# Altium project Power Switching Board.PrjPcb
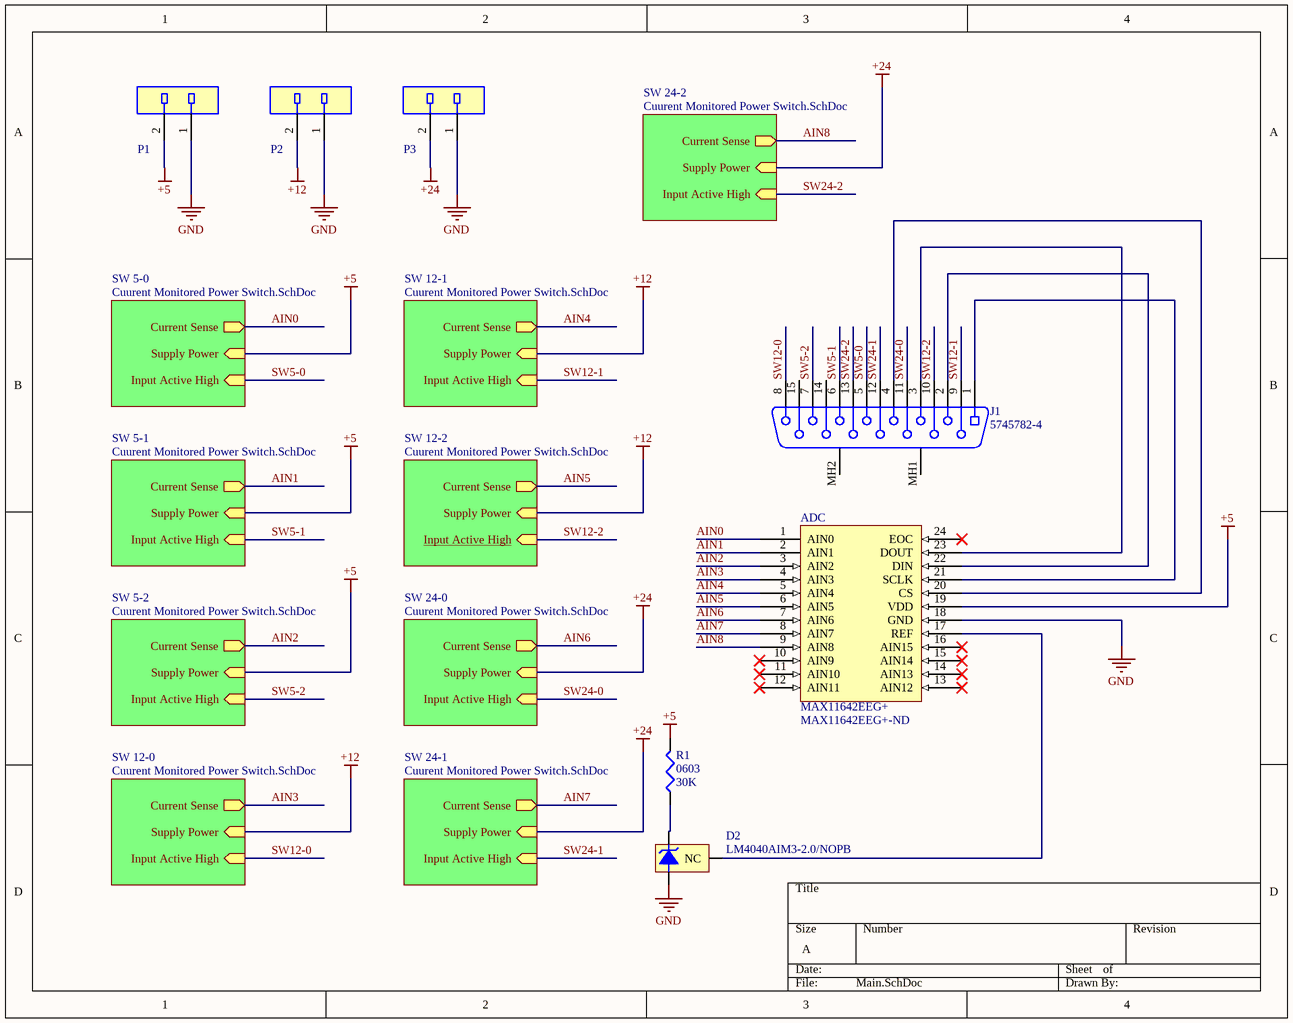
[diagram p0: Main.SchDoc]
2 sheets, 70 parts. Net scope: hierarchical (ports join the sheet entries above them; power ports are global).
Board file: Main.PcbDoc
Sheets:
  Main.SchDoc
    SW 5-0 = Cuurent Monitored Power Switch.SchDoc
    SW 5-1 = Cuurent Monitored Power Switch.SchDoc
    SW 5-2 = Cuurent Monitored Power Switch.SchDoc
    SW 12-0 = Cuurent Monitored Power Switch.SchDoc
    SW 12-1 = Cuurent Monitored Power Switch.SchDoc
    SW 12-2 = Cuurent Monitored Power Switch.SchDoc
    SW 24-0 = Cuurent Monitored Power Switch.SchDoc
    SW 24-1 = Cuurent Monitored Power Switch.SchDoc
    SW 24-2 = Cuurent Monitored Power Switch.SchDoc

## Sheet Main.SchDoc
size A

### Parts
ADC  MAX11642EEG+  Supplier Part Number 1: MAX11642EEG+-ND  [QSOP-24]
D2  LM4040AIM3-2.0/NOPB  [MF03A_L]
J1  5745782-4  [TECO-5745782-4_V]
P1  70553-0001  [Molex_70553-0001_MFG]  (value not drawn)
P2  70553-0001  [Molex_70553-0001_MFG]  (value not drawn)
P3  70553-0001  [Molex_70553-0001_MFG]  (value not drawn)
R1  0603  value 30K  [J1-0603]

### Sub-sheets
SW 5-0 = Cuurent Monitored Power Switch.SchDoc: Current Sense (out), Supply Power (in), Input Active High (in)
SW 5-1 = Cuurent Monitored Power Switch.SchDoc: Current Sense (out), Supply Power (in), Input Active High (in)
SW 5-2 = Cuurent Monitored Power Switch.SchDoc: Current Sense (out), Supply Power (in), Input Active High (in)
SW 12-0 = Cuurent Monitored Power Switch.SchDoc: Current Sense (out), Supply Power (in), Input Active High (in)
SW 12-1 = Cuurent Monitored Power Switch.SchDoc: Current Sense (out), Supply Power (in), Input Active High (in)
SW 12-2 = Cuurent Monitored Power Switch.SchDoc: Current Sense (out), Supply Power (in), Input Active High (in)
SW 24-0 = Cuurent Monitored Power Switch.SchDoc: Current Sense (out), Supply Power (in), Input Active High (in)
SW 24-1 = Cuurent Monitored Power Switch.SchDoc: Current Sense (out), Supply Power (in), Input Active High (in)
SW 24-2 = Cuurent Monitored Power Switch.SchDoc: Current Sense (out), Supply Power (in), Input Active High (in)

### Nets
+5: ADC.19(VDD) P1.2 R1.2 ; sheet SW 5-0/Supply Power, sheet SW 5-1/Supply Power, sheet SW 5-2/Supply Power
+12: P2.2 ; sheet SW 12-0/Supply Power, sheet SW 12-1/Supply Power, sheet SW 12-2/Supply Power
+24: P3.2 ; sheet SW 24-0/Supply Power, sheet SW 24-1/Supply Power, sheet SW 24-2/Supply Power
GND: ADC.18(GND) D2.2(-V) P1.1 P2.1 P3.1
AIN0: ADC.1(AIN0) ; sheet SW 5-0/Current Sense
AIN1: ADC.2(AIN1) ; sheet SW 5-1/Current Sense
AIN2: ADC.3(AIN2) ; sheet SW 5-2/Current Sense
AIN3: ADC.4(AIN3) ; sheet SW 12-0/Current Sense
AIN4: ADC.5(AIN4) ; sheet SW 12-1/Current Sense
AIN5: ADC.6(AIN5) ; sheet SW 12-2/Current Sense
AIN6: ADC.7(AIN6) ; sheet SW 24-0/Current Sense
AIN7: ADC.8(AIN7) ; sheet SW 24-1/Current Sense
AIN8: ADC.9(AIN8) ; sheet SW 24-2/Current Sense
SW5-0: J1.5 ; sheet SW 5-0/Input Active High
SW5-1: J1.6 ; sheet SW 5-1/Input Active High
SW5-2: J1.7 ; sheet SW 5-2/Input Active High
SW12-0: J1.8 ; sheet SW 12-0/Input Active High
SW12-1: J1.9 ; sheet SW 12-1/Input Active High
SW12-2: J1.10 ; sheet SW 12-2/Input Active High
SW24-0: J1.11 ; sheet SW 24-0/Input Active High
SW24-1: J1.12 ; sheet SW 24-1/Input Active High
SW24-2: J1.13 ; sheet SW 24-2/Input Active High
NetADC_17: ADC.17(REF) D2.3(NC)
NetADC_20: ADC.20(CS) J1.4
NetADC_21: ADC.21(SCLK) J1.1
NetADC_22: ADC.22(DIN) J1.2
NetADC_23: ADC.23(DOUT) J1.3
NetD2_1: D2.1(+V) R1.1

Not connected (* = marked no-connect by the designer): ADC 10(AIN9)* 11(AIN10)* 12(AIN11)* 13(AIN12)* 14(AIN13)* 15(AIN14)* 16(AIN15)* 24(EOC)*; J1 14 15 MH1 MH2

### Library data of the parts
ADC = MAX11642EEG+: ADC Single SAR 300ksps 8-bit Serial 24-Pin QSOP; Manufacturer: Maxim; Sampling Rate: 300000S/s; Resolution: 8b; Number of A/D Converters: 1; Number of Analog Inputs: 16; Polarity: Unipolar; Signal to Noise Ratio (SNR): 49dB; Conversion Rate: 300KS/s; Operating Supply Voltage: 5.25V; Number of Bits: 8; Interface: SPI,Serial; Max Power Dissipation: 762mW; Supplier 1: Digi-Key; Manufacturer Part Number: MAX11642EEG+; RoHS: Yes; Category: Analog to Digital Converters (ADCs); Stock 1: 132; Pricing 1: 1=4.05000, 10=3.64100, 25=3.44200, 100=2.83000, 250=2.53940, 500=2.53200 (USD); Mount: Surface Mount; Case/Package: QSOP; Number of Pins: 24; Min Operating Temperature: -40°C; Max Operating Temperature: 85°C; Supply Type: Single; Number of Converters: 1; Package Quantity: 1; Packaging: Rail/Tube; Radiation Hardening: No; ComponentLink1URL: https://datasheet.ciiva.com/1275/max11638-max11643-1275940.pdf?src-supplier=Digi-Key; ComponentLink1Description: https://datasheet.ciiva.com/1275/max11638-max11643-1275940.pdf?src-supplier=Digi-Key; ComponentLink2URL: https://datasheet.ciiva.com/14260/max11638-max11643-14260779.pdf?src-supplier=Avnet; ComponentLink2Description: https://datasheet.ciiva.com/14260/max11638-max11643-14260779.pdf?src-supplier=Avnet; ComponentLink3URL: https://datasheet.ciiva.com/16611/max11638-max11643-16611753.pdf?src-supplier=Avnet+Europe; ComponentLink3Description: https://datasheet.ciiva.com/16611/max11638-max11643-16611753.pdf?src-supplier=Avnet+Europe
D2 = CMP-0074-00630-2: Precision Micropower Shunt Voltage Reference, 3-pin SOT-23, Pb-Free; Manufacturer: National Semiconductor; Manufacturer Part Number: LM4040EIM7-2.0/NOPB; CompType: Voltage Reference IC; PackageTopMarking: RJA*XTT; PowerWise: N; Output Voltage: 2.048V; Max Output Current: 15mA; Temperature Coefficient: 150ppm/°C; Cathode Current: 70uA; Tolerance: 2%; Number of Channels: 1; ComponentLink2Description: LM4040 Web Page; ComponentLink1URL: http://www.national.com/ds/LM/LM4040.pdf; RevisionNote: Component URLs added; ComponentLink3URL: http://www.national.com/packaging/folders/mf03a.html; PackageReference: MF03A; PackageDescription: Molded SOT-23, .115 x .051 x .037in Body, 3 Lead, .075 in Pitch; ComponentLink2URL: http://www.national.com/pf/LM/LM4040.html; DatasheetVersion: Apr-2005; ComponentLink3Description: MF03A Package Page; PinCount: 3; ComponentLink1Description: LM4040 Datasheet; PackageVersion: revB, Mar-2003; RoHS: Y; Supplier 1: Digi-Key; Category: Voltage References; Stock 1: 2945; Pricing 1: 1=0.44000, 10=0.37500, 25=0.34960, 100=0.25980, 250=0.21980, 500=0.20982 (USD); Mount: Surface Mount; Case/Package: SC; Number of Pins: 5; Min Operating Temperature: -40°C; Max Operating Temperature: 85°C; Output Current: 15mA; Max Output Voltage: 2.048V; Reference Type: Shunt; Packaging: Tape and Reel; Package Quantity: 1000; Radiation Hardening: No; Lead Free: Lead Free; ComponentLink4URL: https://datasheet.ciiva.com/6593/lm4040-n-6593128.pdf?src-supplier=Digi-Key; ComponentLink4Description: https://datasheet.ciiva.com/6593/lm4040-n-6593128.pdf?src-supplier=Digi-Key; ComponentLink5URL: https://datasheet.ciiva.com/26067/lm4040-n-26067450.pdf?src-supplier=Avnet+Europe; ComponentLink5Description: https://datasheet.ciiva.com/26067/lm4040-n-26067450.pdf?src-supplier=Avnet+Europe; ComponentLink6URL: https://datasheet.ciiva.com/14198/lm4040-n-q1-14198445.pdf?src-supplier=Avnet; ComponentLink6Description: https://datasheet.ciiva.com/14198/lm4040-n-q1-14198445.pdf?src-supplier=Avnet
J1 = CMP-2000-05646-1: Female D-Sub Connector, Pitch 2.74 mm, 2 Row, 15 Position, Height 12.93 mm, Tail Length 3.18 mm, -55 to 105 degC, RoHS, Tray; Manufacturer: TE Connectivity; Voltage Rating: 125V; Featured Product: AMPLIMITED-SubminiatureConnectors; Flange Feature: Housing/Shell(4-40); Current Rating: 6A; Number of Positions: 15; Catalog Drawings: AMPD-SubMale.318; Mating Products: 1-745494-8-ND / -CONNPLUG15POS26-22AWGGOLD/FL / A34118-ND / -CONND-SUBPLUG15P22-26AWGAU / A32503-ND / -CONNDSUBPLUG15POSSLDCUP / AMR15B-ND / -CONND-SUBPLUG15POSGOLD / AML15B-ND / -CONND-SUBPLUG15POSGOLD / A31968-ND / -CONND-SUBPLUG15P22-26AWGAU / A31967-ND / -CONND-SUBPLUG15P26-30AWGAU; Connector Type: Receptacle,FemaleSockets; Dynamic Catalog: AMPLIMITEHD-20Series; 3D Model: 5745782-4.pdf; Other Names: A32076; Product Training Modules: AMPLIMITED-SubConnectors; Features: GroundStrap; Termination: Solder; Mounting Type: ThroughHole,RightAngle; Contact Finish Thickness: 30µin(0.76µm); Shell Material, Finish: Steel,TinPlated; Category: Connectors,Interconnects; Shell Size, Connector Layout: 2(DA,A); Package Description: Female D-Sub Connector, Pitch 2.74 mm, 2 Row, 15 Position, Height 12.93 mm, Tail Length 3.18 mm; Color: Black; Family: D-SubConnectors; Series: AMPLIMITEHD-20; Contact Finish: Gold; Mounting Technology: ThroughHole; Housing Material: Thermoplastic; Package Reference: 5745782-4; RoHS Information: 5745782-4StatementofCompliance; Standard Package: 104; Datasheet Version: Rev. R, 08/2011; Manufacturer URL: http://www.te.com/; Number of Rows: 2; Operating Temperature: -55°C~105°C; Connector Style: D-Sub; Datasheet URL: http://www.te.com/commerce/DocumentDelivery/DDEController?Action=srchrtrv&DocNm=5745782&DocType=Customer+Drawing&DocLang=English; Contact Type: Signal
P1-P3 = 70553-0001: Molex Connector 2 pin 90 degree through hole .100
R1 = Res3: Resistor; Published: 8-Jun-2000; LatestRevisionDate: 29-May-2009; LatestRevisionNote: IPC-7351 Footprint Added.; PackageReference: J1-0603; Publisher: Altium Limited; PackageDescription: Chip Resistor

## Sheet Cuurent Monitored Power Switch.SchDoc
size A
Used 9 times, as channels SW 5-0, SW 5-1, SW 5-2, SW 12-0, SW 12-1, SW 12-2, SW 24-0, SW 24-1, SW 24-2. Parts and nets are listed once, with the designators drawn on the sheet.
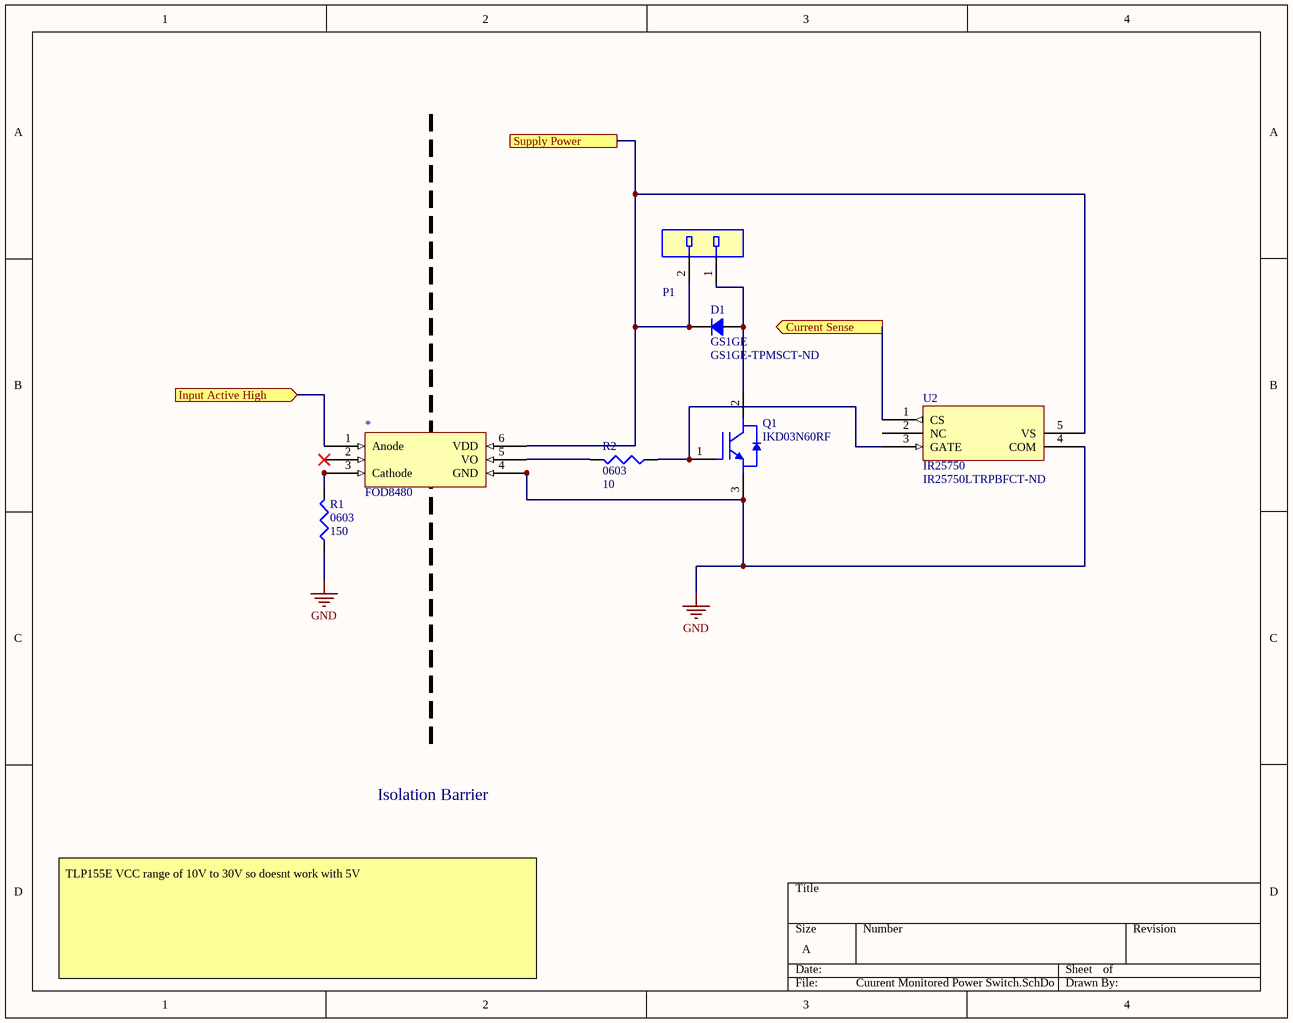
[diagram p1: Cuurent Monitored Power Switch.SchDoc]

### Parts
*  FOD8480  [SOIC127P1030X348-6N]
D1  GS1GE  Supplier Part Number 1: GS1GE-TPMSCT-ND  [DO214AC SMA]
P1  70553-0001  [Molex_70553-0001_MFG]  (value not drawn)
Q1  IKD03N60RF  [INF-PG-TO252-3-21_V]
R1  0603  value 150  [J1-0603]
R2  0603  value 10  [J1-0603]
U2  IR25750  Supplier Part Number 1: IR25750LTRPBFCT-ND  [SOT23-5]

### Ports
Current Sense (out), Input Active High (in), Supply Power

### Nets
GND: *.4(GND) Q1.3(E) R1.1 U2.4(COM)
Current Sense: U2.1(CS) ; port Current Sense
Input Active High: *.1(Anode) ; port Input Active High
Supply Power: *.6(VDD) D1.2 P1.2 U2.5(VS) ; port Supply Power
Net*_3: *.3(Cathode) R1.2
Net*_5: *.5(VO) R2.2
NetD1_1: D1.1 P1.1 Q1.2(C)
NetQ1_1: Q1.1(G) R2.1 U2.3(GATE)

Not connected (* = marked no-connect by the designer): * 2*; U2 2(NC)

### Channels
SW 5-0: designators end in _1; ports Current Sense=AIN0 Input Active High=SW5-0 Supply Power=+5
SW 5-1: designators end in _2; ports Current Sense=AIN1 Input Active High=SW5-1 Supply Power=+5
SW 5-2: designators end in _3; ports Current Sense=AIN2 Input Active High=SW5-2 Supply Power=+5
SW 12-0: designators end in _4; ports Current Sense=AIN3 Input Active High=SW12-0 Supply Power=+12
SW 12-1: designators end in _5; ports Current Sense=AIN4 Input Active High=SW12-1 Supply Power=+12
SW 12-2: designators end in _6; ports Current Sense=AIN5 Input Active High=SW12-2 Supply Power=+12
SW 24-0: designators end in _7; ports Current Sense=AIN6 Input Active High=SW24-0 Supply Power=+24
SW 24-1: designators end in _8; ports Current Sense=AIN7 Input Active High=SW24-1 Supply Power=+24
SW 24-2: designators end in _9; ports Current Sense=AIN8 Input Active High=SW24-2 Supply Power=+24

### Notes on the sheet
- Isolation Barrier
- TLP155E VCC range of 10V to 30V so doesnt work with 5V

### Library data of the parts
D1 = GS1GE: Diode Switching 400V 1A 2-Pin SMAE T/R; Manufacturer: MCC; Manufacturer Part Number: GS1GE-TP; Supplier 1: Digi-Key; RoHS: Yes; Category: Rectifier Diodes; Stock 1: 2437; Pricing 1: 1=0.27000, 10=0.22100, 25=0.18560, 100=0.09060, 250=0.08920, 500=0.07560, 1000=0.05253, 2500=0.04882 (USD); Mount: Surface Mount; Number of Pins: 2; Max Reverse Voltage (DC): 400V; Packaging: Tape and Reel; Average Rectified Current: 1A; Lead Free: Lead Free; ComponentLink1URL: https://media.digikey.com/pdf/Data%20Sheets/Micro%20Commercial%20PDFs/GS1AE-GS1ME(SMAE)_Rev.F_Oct19_2015_DS.pdf?src-supplier=Digi-Key; ComponentLink1Description: https://media.digikey.com/pdf/Data%20Sheets/Micro%20Commercial%20PDFs/GS1AE-GS1ME(SMAE)_Rev.F_Oct19_2015_DS.pdf?src-supplier=Digi-Key; ComponentLink2URL: http://components.arrow.com/part/dataview/43471173S9417573N2022?src-supplier=Arrow; ComponentLink2Description: http://components.arrow.com/part/dataview/43471173S9417573N2022?src-supplier=Arrow; ComponentLink3URL: http://www.mccsemi.com/up_pdf/GS1AE-GS1ME(SMAE).pdf?src-supplier=Digi-Key; ComponentLink3Description: http://www.mccsemi.com/up_pdf/GS1AE-GS1ME(SMAE).pdf?src-supplier=Digi-Key
P1 = 70553-0001: 24V power in
Q1 = CMP-1166-00103-1: 600 V TrenchStop RC-Series for Hard Switching Applications up to 30 KHz, 5 A IC, -40 to 175 degC, PG-TO252-3-21, Reel, Green; Manufacturer: Infineon; Green: TRUE; VCE(sat)(typ): 2.2Â V; tr(typ): 8 ns; IC(max)@ 100degrees: 2.5Â A; Eoff(typ): 0.04Â mJ; Eon(typ): 0.05Â mJ; VF (typ): 2.1Â V; Switching Frequency: RC Drives Fast Series 4 - 30 kHz; Qrr(typ): 0.06Â uC; tf(typ): 93 ns; IFpuls(max): 7.5Â A; IF (max): 5Â A; td(off) (typ): 128 ns; td(on)(typ): 10 ns; Irrm(typ): 3.8 A; Ptot(max): 53.6 W; VCE(max): 600Â V; QGate (typ): 17.1Â nC; ComponentLink1URL: http://www.infineon.com/; Mounting Technology: Surface Mount; Packing: Reel; ComponentLink2Description: Datasheet; ComponentLink3Description: Package Specification; Product Type: IKD03N60RF; PackageDescription: 3-Pin Plastic (Green) Transistor Single Outline Package, Body 6.1 x 6.6 mm, Pitch 2.29 mm; ComponentLink2URL: http://www.infineon.com/dgdl/IKD03N60RF+Rev+2.2.pdf?folderId=db3a3043156fd5730115f56849b61941&fileId=db3a30433c5c92fb013c5d3978350068; IC(max)@ 25degrees: 5Â A; PartNumber: IKD03N60RF; ICpuls(max): 7.5Â A; DatasheetVersion: Rev. 2.2; PackageReference: PG-TO252-3-21; ComponentLink1Description: Manufacturer URL; ComponentLink3URL: http://www.infineon.com/cms/packages/SMD_-_Surface_Mounted_Devices/P-PG-TO252/P-PG-TO252-03-021.html?__locale=en; Halogen-free: TRUE
R1 R2 = Res3: Resistor; Published: 8-Jun-2000; LatestRevisionDate: 29-May-2009; LatestRevisionNote: IPC-7351 Footprint Added.; PackageReference: J1-0603; Publisher: Altium Limited; PackageDescription: Chip Resistor
U2 = IR25750: 1.8V/2.5V/3.3V/5V/9V/12V/15V/18V/24V 5-Pin SOT-23 T/R; Manufacturer: International Rectifier; Manufacturer Part Number: IR25750LTRPBF; Operating Supply Current: 50uA; Max Supply Voltage: 600V; Min Supply Voltage: -3V; Supplier 1: Digi-Key; RoHS: Yes; Category: Power Management ICs; Stock 1: 2771; Pricing 1: 1=0.79000, 10=0.69900, 25=0.65680, 100=0.49790, 250=0.42376, 500=0.40256, 1000=0.30721 (USD); Mount: Surface Mount; Case/Package: SOT-23-5; Number of Pins: 5; Weight: 0.001058oz; Min Operating Temperature: -40°C; Max Operating Temperature: 125°C; Package Quantity: 1; Packaging: Tape and Reel; Max Supply Current: 50uA; Length: 3mm; Height: 1.3mm; Width: 1.75mm; Lead Free: Lead Free; ComponentLink1URL: https://datasheet.ciiva.com/29590/ir25750lpbf-preliminary-29590193.pdf?src-supplier=Digi-Key; ComponentLink1Description: https://datasheet.ciiva.com/29590/ir25750lpbf-preliminary-29590193.pdf?src-supplier=Digi-Key

## Nets that join several sheets
+5: Main (ADC.19 P1.2 R1.2), SW 5-0 (*_1.6 D1_1.2 P1_1.2 U2_1.5), SW 5-1 (*_2.6 D1_2.2 P1_2.2 U2_2.5), SW 5-2 (*_3.6 D1_3.2 P1_3.2 U2_3.5)
+12: Main (P2.2), SW 12-0 (*_4.6 D1_4.2 P1_4.2 U2_4.5), SW 12-1 (*_5.6 D1_5.2 P1_5.2 U2_5.5), SW 12-2 (*_6.6 D1_6.2 P1_6.2 U2_6.5)
+24: Main (P3.2), SW 24-0 (*_7.6 D1_7.2 P1_7.2 U2_7.5), SW 24-1 (*_8.6 D1_8.2 P1_8.2 U2_8.5), SW 24-2 (*_9.6 D1_9.2 P1_9.2 U2_9.5)
GND: Main (5 pins), SW 5-0 (*_1.4 Q1_1.3 R1_1.1 U2_1.4), SW 5-1 (*_2.4 Q1_2.3 R1_2.1 U2_2.4), SW 5-2 (*_3.4 Q1_3.3 R1_3.1 U2_3.4), SW 12-0 (*_4.4 Q1_4.3 R1_4.1 U2_4.4), SW 12-1 (*_5.4 Q1_5.3 R1_5.1 U2_5.4), SW 12-2 (*_6.4 Q1_6.3 R1_6.1 U2_6.4), SW 24-0 (*_7.4 Q1_7.3 R1_7.1 U2_7.4), SW 24-1 (*_8.4 Q1_8.3 R1_8.1 U2_8.4), SW 24-2 (*_9.4 Q1_9.3 R1_9.1 U2_9.4)
AIN0: Main (ADC.1), SW 5-0 (U2_1.1)
AIN1: Main (ADC.2), SW 5-1 (U2_2.1)
AIN2: Main (ADC.3), SW 5-2 (U2_3.1)
AIN3: Main (ADC.4), SW 12-0 (U2_4.1)
AIN4: Main (ADC.5), SW 12-1 (U2_5.1)
AIN5: Main (ADC.6), SW 12-2 (U2_6.1)
AIN6: Main (ADC.7), SW 24-0 (U2_7.1)
AIN7: Main (ADC.8), SW 24-1 (U2_8.1)
AIN8: Main (ADC.9), SW 24-2 (U2_9.1)
SW5-0: Main (J1.5), SW 5-0 (*_1.1)
SW5-1: Main (J1.6), SW 5-1 (*_2.1)
SW5-2: Main (J1.7), SW 5-2 (*_3.1)
SW12-0: Main (J1.8), SW 12-0 (*_4.1)
SW12-1: Main (J1.9), SW 12-1 (*_5.1)
SW12-2: Main (J1.10), SW 12-2 (*_6.1)
SW24-0: Main (J1.11), SW 24-0 (*_7.1)
SW24-1: Main (J1.12), SW 24-1 (*_8.1)
SW24-2: Main (J1.13), SW 24-2 (*_9.1)